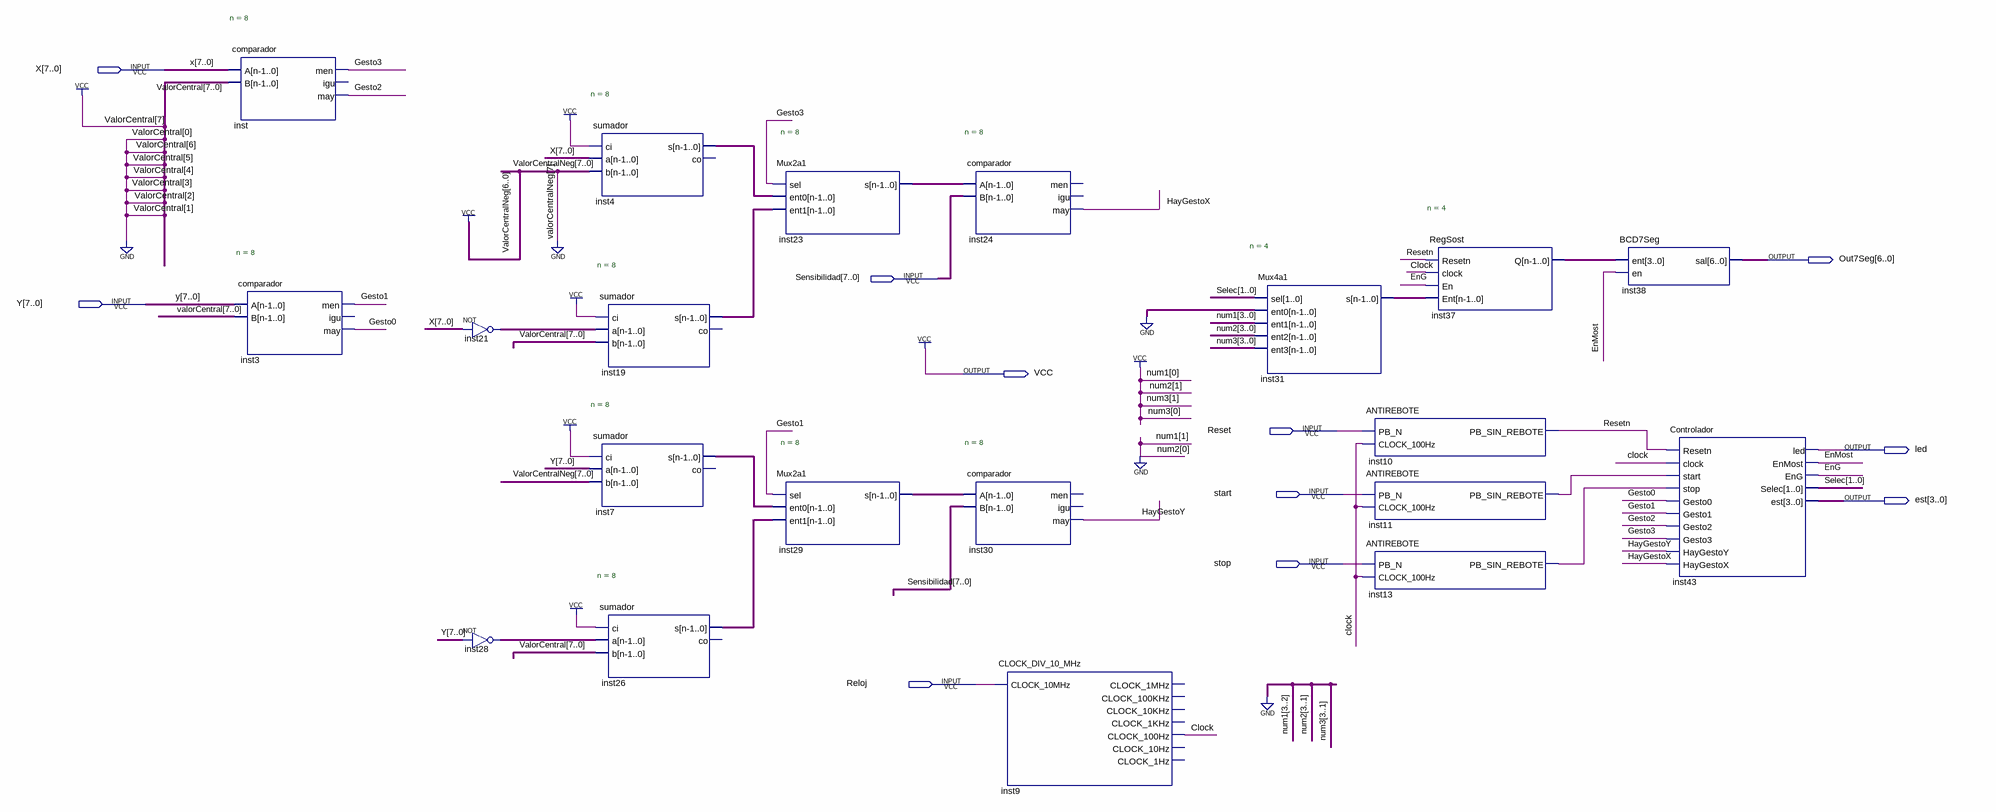
[diagram p0: schematic sheet]
// Quartus schematic Gestos.bdf as structural Verilog: 20 symbols, 11 pins
module Gestos (
  input  [7:0] X,
  input  [7:0] Sensibilidad,
  input  [7:0] Y,
  input  Reset,
  input  start,
  input  stop,
  input  Reloj,
  output [6:0] Out7Seg,
  output VCC,
  output led,
  output [3:0] est
);

  wire Clock, EnG, EnMost, Gesto0, Gesto1, Gesto2, Gesto3, HayGestoX, HayGestoY, inst11_pb_sin_rebote,
       inst13_pb_sin_rebote, Resetn;
  wire [1:0] Selec;
  wire [3:0] inst31_s, inst37_q;
  wire [3:2] num1, num3;
  wire [7:0] inst4_s, inst7_s, inst19_s, inst21_out, inst23_s, inst26_s, inst28_out, inst29_s;

  comparador #(.n(8)) inst (.A(X), .B(8'b10000000), .men(Gesto3), .may(Gesto2));  // open: igu
  comparador #(.n(8)) inst3 (.A(Y), .B(8'b10000000), .men(Gesto1), .may(Gesto0));  // open: igu
  assign inst21_out = ~X;  // NOT inst21, 8 bits wide
  assign inst28_out = ~Y;  // NOT inst28, 8 bits wide
  sumador #(.n(8)) inst4 (.ci(1'b1), .a(X), .b(8'b01111111), .s(inst4_s));  // open: co
  sumador #(.n(8)) inst19 (.ci(1'b1), .a(inst21_out), .b(8'b10000000), .s(inst19_s));  // open: co
  sumador #(.n(8)) inst7 (.ci(1'b1), .a(Y), .b(8'b01111111), .s(inst7_s));  // open: co
  sumador #(.n(8)) inst26 (.ci(1'b1), .a(inst28_out), .b(8'b10000000), .s(inst26_s));  // open: co
  Mux2a1 #(.n(8)) inst23 (.sel(Gesto3), .ent0(inst4_s), .ent1(inst19_s), .s(inst23_s));
  Mux2a1 #(.n(8)) inst29 (.sel(Gesto1), .ent0(inst7_s), .ent1(inst26_s), .s(inst29_s));
  comparador #(.n(8)) inst24 (.A(inst23_s), .B(Sensibilidad), .may(HayGestoX));  // open: men, igu
  comparador #(.n(8)) inst30 (.A(inst29_s), .B(Sensibilidad), .may(HayGestoY));  // open: men, igu
  CLOCK_DIV_10_MHz inst9 (
    .CLOCK_10MHz(Reloj), .CLOCK_100Hz(Clock));  // open: CLOCK_1MHz, CLOCK_100KHz, CLOCK_10KHz, CLOCK_1KHz, CLOCK_10Hz, CLOCK_1Hz
  Mux4a1 #(.n(4)) inst31 (
    .sel(Selec), .ent0(4'b0000), .ent1({num1, 2'b00}), .ent2(4'b0000), .ent3({num3, 2'b00}), .s(inst31_s));
  ANTIREBOTE inst10 (.PB_N(Reset), .CLOCK_100Hz(Clock), .PB_SIN_REBOTE(Resetn));
  ANTIREBOTE inst11 (.PB_N(start), .CLOCK_100Hz(Clock), .PB_SIN_REBOTE(inst11_pb_sin_rebote));
  ANTIREBOTE inst13 (.PB_N(stop), .CLOCK_100Hz(Clock), .PB_SIN_REBOTE(inst13_pb_sin_rebote));
  RegSost #(.n(4)) inst37 (.Resetn(Resetn), .clock(Clock), .En(EnG), .Ent(inst31_s), .Q(inst37_q));
  BCD7Seg inst38 (.ent(inst37_q), .en(EnMost), .sal(Out7Seg));
  Controlador inst43 (
    .Resetn(Resetn), .clock(Clock), .start(inst11_pb_sin_rebote), .stop(inst13_pb_sin_rebote),
    .Gesto0(Gesto0), .Gesto1(Gesto1), .Gesto2(Gesto2), .Gesto3(Gesto3), .HayGestoY(HayGestoY),
    .HayGestoX(HayGestoX), .led(led), .EnMost(EnMost), .EnG(EnG), .Selec(Selec), .est(est));

  assign VCC = 1'b1;
endmodule
